# Altium schematic sheet MOD_ILUMINACION.SchDoc
size A4
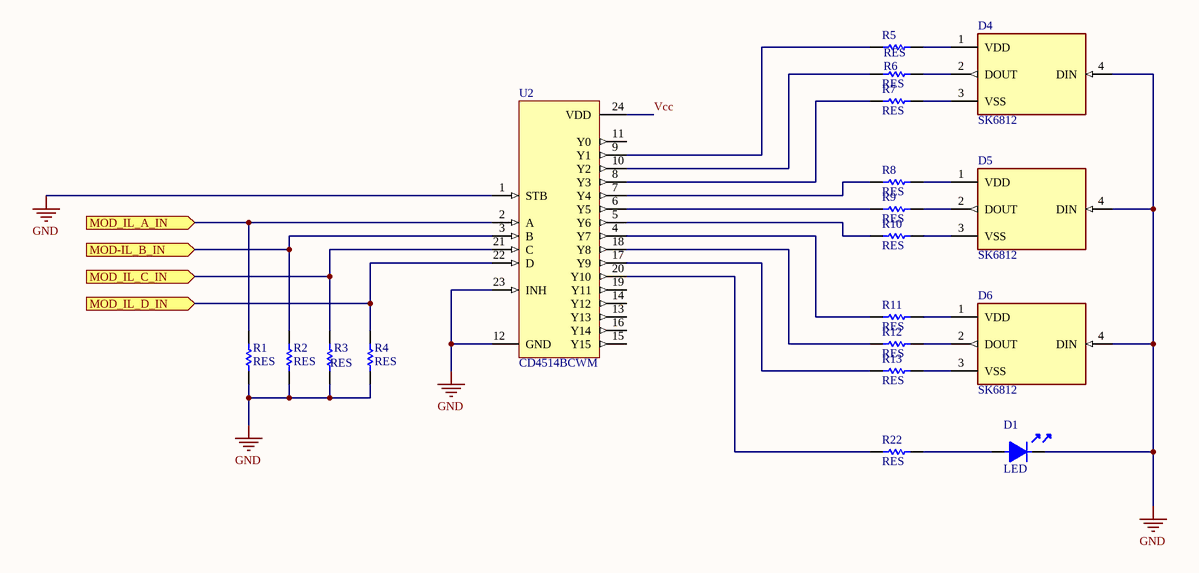
[diagram p0: MOD_ILUMINACION.SchDoc]

## Parts
D1  LED  [0805]
D4  SK6812  [LED_SK6812]
D5  SK6812  [LED_SK6812]
D6  SK6812  [LED_SK6812]
R1  RES  [0805]
R2  RES  [0805]
R3  RES  [0805]
R4  RES  [0805]
R5  RES  [0805]
R6  RES  [0805]
R7  RES  [0805]
R8  RES  [0805]
R9  RES  [0805]
R10  RES  [0805]
R11  RES  [0805]
R12  RES  [0805]
R13  RES  [0805]
R22  RES  [0805]
U2  CD4514BCWM  [M24B_M]

## Ports
MOD-IL_B_IN (in), MOD_IL_A_IN (in), MOD_IL_C_IN (in), MOD_IL_D_IN (in)

## Nets
GND: D1.2 D4.4(DIN) D5.4(DIN) D6.4(DIN) R1.2 R2.2 R3.2 R4.2 U2.1(STB) U2.12(GND) U2.23(INH)
MOD-IL_B_IN: R2.1 U2.3(B) ; port MOD-IL_B_IN
MOD_IL_A_IN: R1.1 U2.2(A) ; port MOD_IL_A_IN
MOD_IL_C_IN: R3.1 U2.21(C) ; port MOD_IL_C_IN
MOD_IL_D_IN: R4.1 U2.22(D) ; port MOD_IL_D_IN
Vcc: U2.24(VDD)
NetD1_1: D1.1 R22.2
NetD4_1: D4.1(VDD) R5.2
NetD4_2: D4.2(DOUT) R6.2
NetD4_3: D4.3(VSS) R7.2
NetD5_1: D5.1(VDD) R8.2
NetD5_2: D5.2(DOUT) R9.2
NetD5_3: D5.3(VSS) R10.2
NetD6_1: D6.1(VDD) R11.2
NetD6_2: D6.2(DOUT) R12.2
NetD6_3: D6.3(VSS) R13.2
NetR5_1: R5.1 U2.9(Y1)
NetR6_1: R6.1 U2.10(Y2)
NetR7_1: R7.1 U2.8(Y3)
NetR8_1: R8.1 U2.7(Y4)
NetR9_1: R9.1 U2.6(Y5)
NetR10_1: R10.1 U2.5(Y6)
NetR11_1: R11.1 U2.4(Y7)
NetR12_1: R12.1 U2.18(Y8)
NetR13_1: R13.1 U2.17(Y9)
NetR22_1: R22.1 U2.20(Y10)

Not connected (* = marked no-connect by the designer): U2 11(Y0) 13(Y13) 14(Y12) 15(Y15) 16(Y14) 19(Y11)

## Library data of the parts
D4-D6 = SK6812: SMD 5050 Full color RGB LED data transmission frequency up to 800Kbps, with 30 fps refresh rate, 5.00x5.00 mm; MF: Shenzhen LED Color Optoelectronic Inc.; Package: SMD-4 Shenzhen LED Color Optoelectronic Inc.; Value: *; Check_prices: https://www.snapeda.com/parts/SK6812/Shenzhen%20LED%20Color%20Optoelectronic%20Inc./view-part/554016/?ref=eda; Price: None; Availability: Unavailable; MP: SK6812; SnapEDA_Link: https://www.snapeda.com/parts/SK6812/Shenzhen%20LED%20Color%20Optoelectronic%20Inc./view-part/554016/?ref=snap
U2 = CD4514BCWM: 4 Bit Latched/4-to-16-Line Decoder; Published: 17-Jul-2002; LatestRevisionDate: 13-Apr-2006; LatestRevisionNote: IPC-7351 Footprint Added.; DatasheetVersion: Jan-1999; PackageVersion: 2000; PackageReference: M24B; Publisher: Altium Limited; PackageDescription: 24-Pin Small Outline Integrated Circuit 1.27 mm Pitch; ComponentLink1Description: Manufacturer Link; ComponentLink1URL: http://www.fairchildsemi.com/; ComponentLink2Description: Datasheet; ComponentLink2URL: http://www.fairchildsemi.com/ds/CD%2FCD4514BC.pdf